# Altium project STB_ValidationBoard.PrjPcb (part 1 of 2)
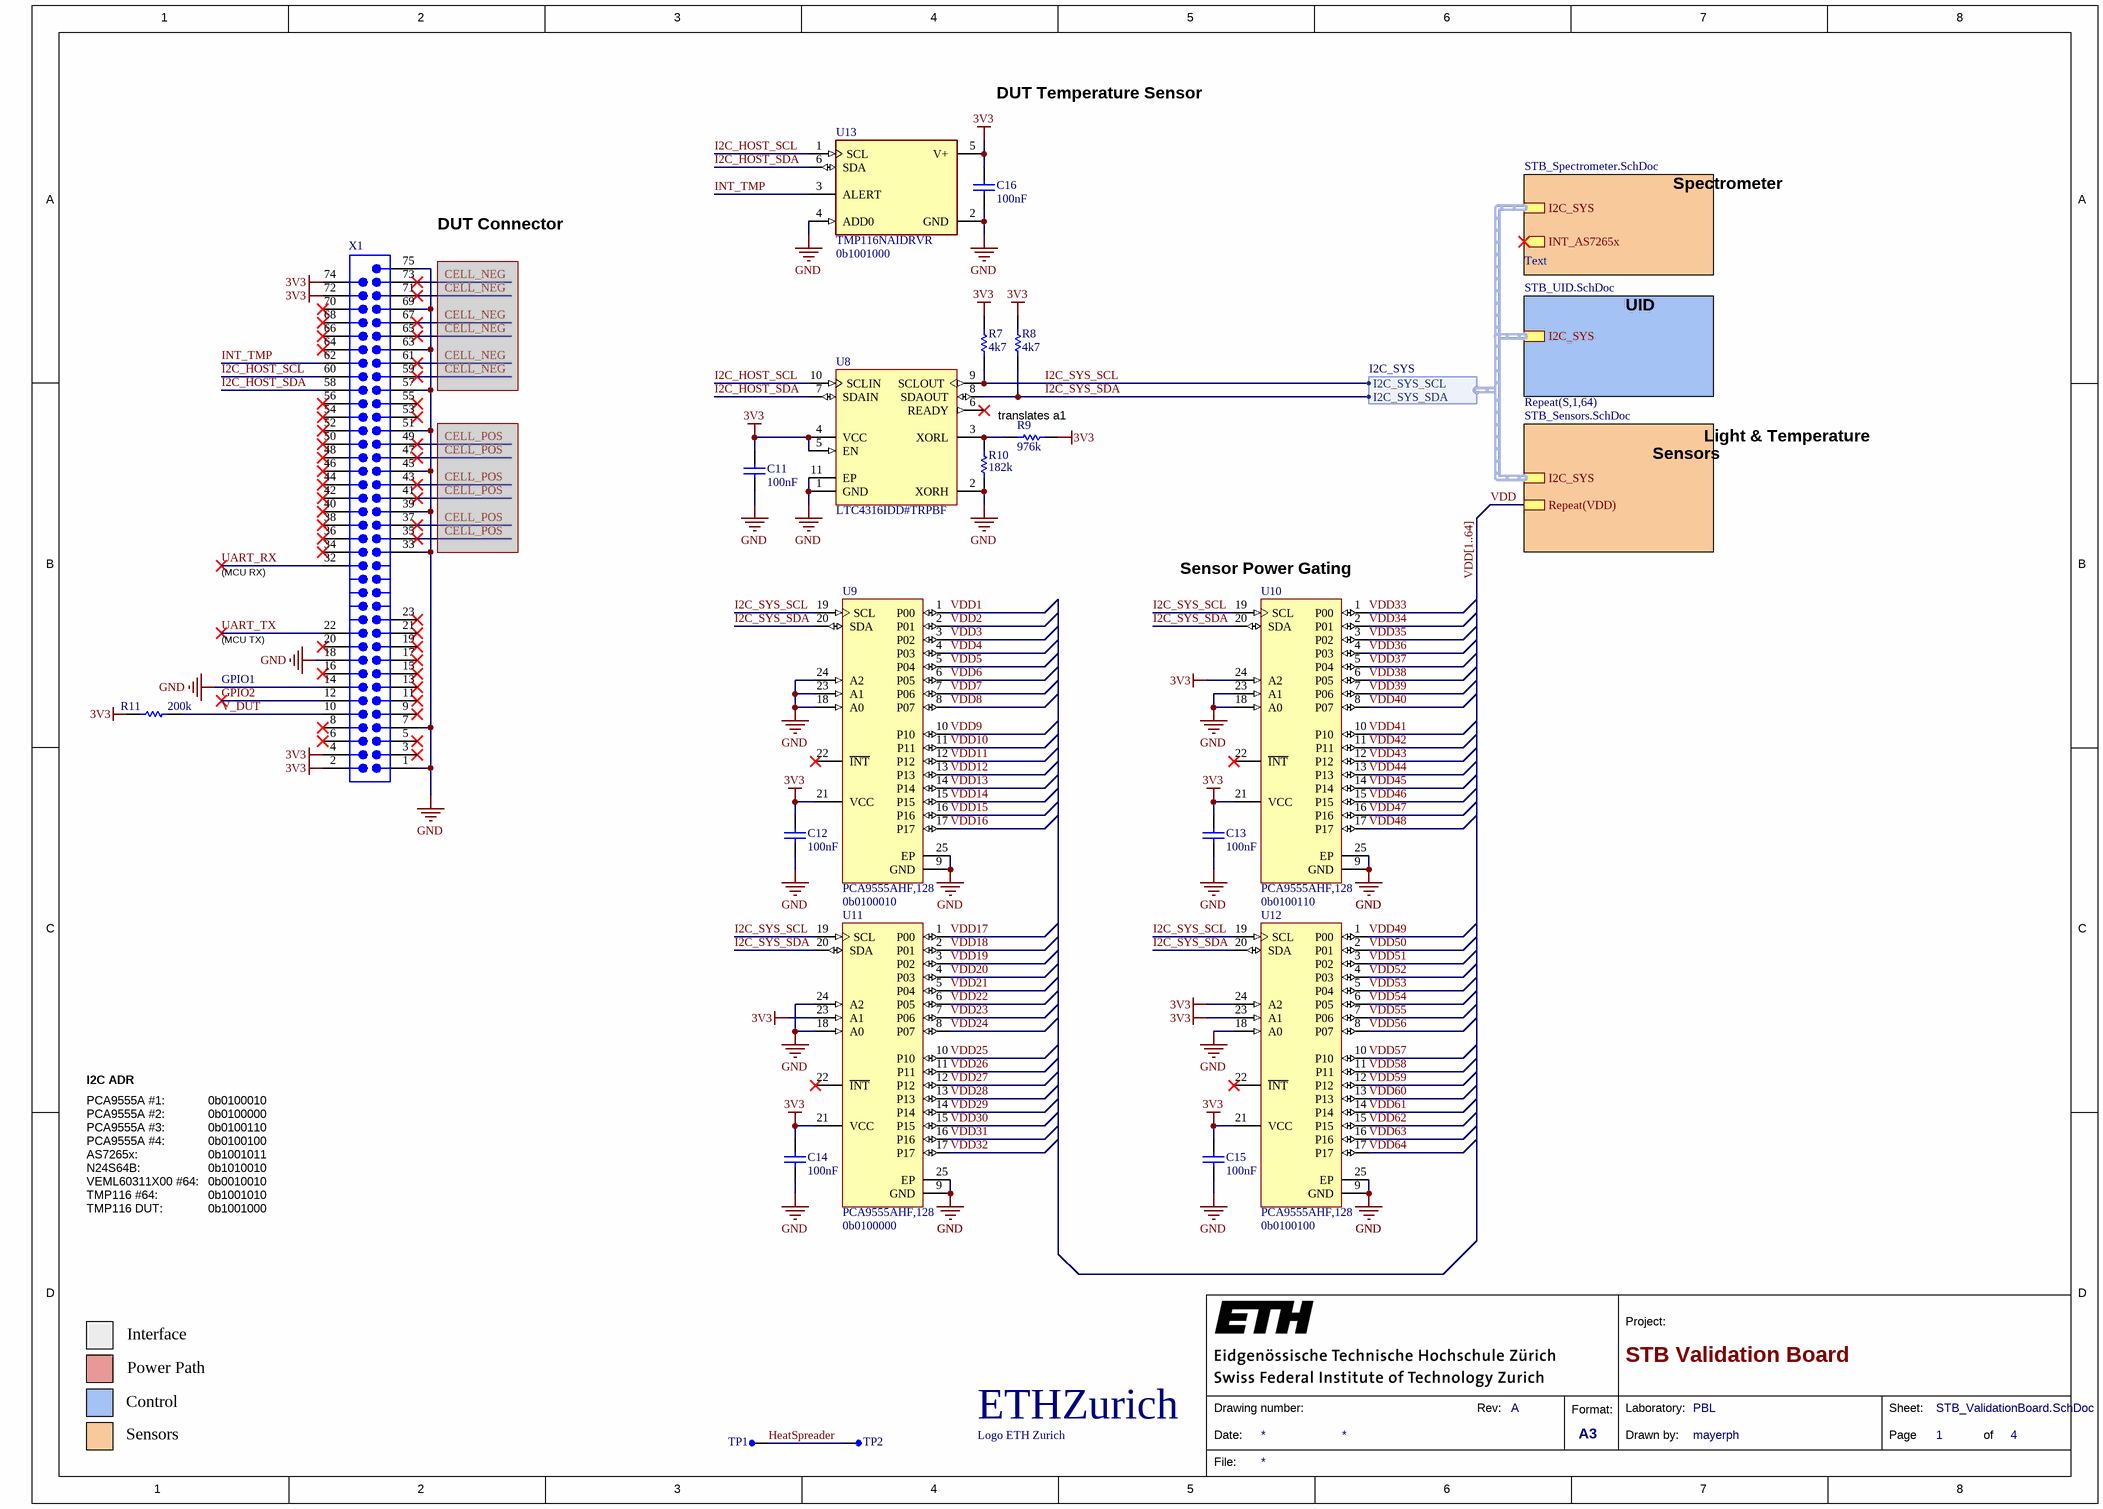
[diagram p0: STB_ValidationBoard.SchDoc]
4 sheets, 235 parts. Net scope: hierarchical (ports join the sheet entries above them; power ports are global).
Board file: STB_ValidationBoard.PcbDoc
Sheets:
  STB_ValidationBoard.SchDoc
    SP = STB_Spectrometer.SchDoc
    TC = STB_UID.SchDoc
    S1 = STB_Sensors.SchDoc
    S2 = STB_Sensors.SchDoc
    S3 = STB_Sensors.SchDoc
    S4 = STB_Sensors.SchDoc
    S5 = STB_Sensors.SchDoc
    S6 = STB_Sensors.SchDoc
    S7 = STB_Sensors.SchDoc
    S8 = STB_Sensors.SchDoc
    S9 = STB_Sensors.SchDoc
    S10 = STB_Sensors.SchDoc
    S11 = STB_Sensors.SchDoc
    S12 = STB_Sensors.SchDoc
    S13 = STB_Sensors.SchDoc
    S14 = STB_Sensors.SchDoc
    S15 = STB_Sensors.SchDoc
    S16 = STB_Sensors.SchDoc
    S17 = STB_Sensors.SchDoc
    S18 = STB_Sensors.SchDoc
    S19 = STB_Sensors.SchDoc
    S20 = STB_Sensors.SchDoc
    S21 = STB_Sensors.SchDoc
    S22 = STB_Sensors.SchDoc
    S23 = STB_Sensors.SchDoc
    S24 = STB_Sensors.SchDoc
    S25 = STB_Sensors.SchDoc
    S26 = STB_Sensors.SchDoc
    S27 = STB_Sensors.SchDoc
    S28 = STB_Sensors.SchDoc
    S29 = STB_Sensors.SchDoc
    S30 = STB_Sensors.SchDoc
    S31 = STB_Sensors.SchDoc
    S32 = STB_Sensors.SchDoc
    S33 = STB_Sensors.SchDoc
    S34 = STB_Sensors.SchDoc
    S35 = STB_Sensors.SchDoc
    S36 = STB_Sensors.SchDoc
    S37 = STB_Sensors.SchDoc
    S38 = STB_Sensors.SchDoc
    S39 = STB_Sensors.SchDoc
    S40 = STB_Sensors.SchDoc
    S41 = STB_Sensors.SchDoc
    S42 = STB_Sensors.SchDoc
    S43 = STB_Sensors.SchDoc
    S44 = STB_Sensors.SchDoc
    S45 = STB_Sensors.SchDoc
    S46 = STB_Sensors.SchDoc
    S47 = STB_Sensors.SchDoc
    S48 = STB_Sensors.SchDoc
    S49 = STB_Sensors.SchDoc
    S50 = STB_Sensors.SchDoc
    S51 = STB_Sensors.SchDoc
    S52 = STB_Sensors.SchDoc
    S53 = STB_Sensors.SchDoc
    S54 = STB_Sensors.SchDoc
    S55 = STB_Sensors.SchDoc
    S56 = STB_Sensors.SchDoc
    S57 = STB_Sensors.SchDoc
    S58 = STB_Sensors.SchDoc
    S59 = STB_Sensors.SchDoc
    S60 = STB_Sensors.SchDoc
    S61 = STB_Sensors.SchDoc
    S62 = STB_Sensors.SchDoc
    S63 = STB_Sensors.SchDoc
    S64 = STB_Sensors.SchDoc

## Sheet STB_ValidationBoard.SchDoc: STB Validation Board
size A3; Author: mayerph; DrawnBy: mayerph; Organization: PBL; Revision: A; SheetNumber: 1; SheetTotal: 4

### Parts
A1  Logo ETH Zurich  [eth-zurich_5mm]  (no BOM)
C11  100nF  [CAPC1050X55X23LL05T13]
C12  100nF  [CAPC1050X55X23LL05T13]
C13  100nF  [CAPC1050X55X23LL05T13]
C14  100nF  [CAPC1050X55X23LL05T13]
C15  100nF  [CAPC1050X55X23LL05T13]
C16  100nF  [CAPC1050X55X23LL05T13]
R7  4k7  [RESC1005X40X25LL05T10]
R8  4k7  [RESC1005X40X25LL05T10]
R9  976k  [RESC1005X40X25LL05T05]
R10  182k  [RESC1005X40X25LL05T05]
R11  200k  [RESC1005X40X25LL05T10]
TP1  testPoint_1mm  [TP-SM-C-100]  (value not drawn)  (no BOM)
TP2  testPoint_1mm  [TP-SM-C-100]  (value not drawn)  (no BOM)
U8  LTC4316IDD#TRPBF  [DFN10(3x3)_N]
U9  PCA9555AHF,128  [RGE0024C]
U10  PCA9555AHF,128  [RGE0024C]
U11  PCA9555AHF,128  [RGE0024C]
U12  PCA9555AHF,128  [RGE0024C]
U13  TMP116NAIDRVR  Address: 0b1001000  [FP-DRV0006B-MFG]
X1  CONN PWR CARD EDGE PCB SLOT MALE  [CON-67_0.5MM_PCB_SLOT]  (value not drawn)  (no BOM)

### Sub-sheets
Repeat(S,1,64) = STB_Sensors.SchDoc: I2C_SYS (harness I2C_SYS), Repeat(VDD)
SP = STB_Spectrometer.SchDoc: I2C_SYS (harness I2C_SYS), INT_AS7265x (out)
TC = STB_UID.SchDoc: I2C_SYS (harness I2C_SYS)

### Harnesses
I2C_SYS: I2C_SYS_SDA, I2C_SYS_SCL

### Nets
3V3: C11.2 C12.2 C13.2 C14.2 C15.2 C16.2 R7.2 R8.2 R9.1 R11.2 U8.4(VCC) U8.5(EN) U9.21(VCC) U10.21(VCC) U10.24(A2) U11.21(VCC) U11.23(A1) U12.21(VCC) U12.23(A1) U12.24(A2) U13.5(V+) X1.2 X1.4 X1.72 X1.74
GND: C11.1 C12.1 C13.1 C14.1 C15.1 C16.1 R10.1 U8.1(GND) U8.2(XORH) U8.11(EP) U9.9(GND) U9.18(A0) U9.23(A1) U9.24(A2) U9.25(EP) U10.9(GND) U10.18(A0) U10.23(A1) U10.25(EP) U11.9(GND) U11.18(A0) U11.24(A2) U11.25(EP) U12.9(GND) U12.18(A0) U12.25(EP) U13.2(GND) U13.4(ADD0) X1.1 X1.7 X1.14 X1.18 X1.33 X1.39 X1.45 X1.51 X1.57 X1.63 X1.69 X1.75
GPIO2: X1.12
HeatSpreader: TP1.1(TP) TP2.1(TP)
I2C_HOST_SCL: U8.10(SCLIN) U13.1(SCL) X1.60
I2C_HOST_SDA: U8.7(SDAIN) U13.6(SDA) X1.58
I2C_SYS_SCL: R7.1 U8.9(SCLOUT) U9.19(SCL) U10.19(SCL) U11.19(SCL) U12.19(SCL) ; sheet SP/I2C_SYS.I2C_SYS_SCL
I2C_SYS_SDA: R8.1 U8.8(SDAOUT) U9.20(SDA) U10.20(SDA) U11.20(SDA) U12.20(SDA) ; sheet SP/I2C_SYS.I2C_SYS_SDA
INT_TMP: U13.3(ALERT) X1.62
UART_RX: X1.32
UART_TX: X1.22
V_DUT: R11.1 X1.10
VDD: sheet Repeat(S,1,64)/Repeat(VDD)
VDD1: U9.1(P00)
VDD2: U9.2(P01)
VDD3: U9.3(P02)
VDD4: U9.4(P03)
VDD5: U9.5(P04)
VDD6: U9.6(P05)
VDD7: U9.7(P06)
VDD8: U9.8(P07)
VDD9: U9.10(P10)
VDD10: U9.11(P11)
VDD11: U9.12(P12)
VDD12: U9.13(P13)
VDD13: U9.14(P14)
VDD14: U9.15(P15)
VDD15: U9.16(P16)
VDD16: U9.17(P17)
VDD17: U11.1(P00)
VDD18: U11.2(P01)
VDD19: U11.3(P02)
VDD20: U11.4(P03)
VDD21: U11.5(P04)
VDD22: U11.6(P05)
VDD23: U11.7(P06)
VDD24: U11.8(P07)
VDD25: U11.10(P10)
VDD26: U11.11(P11)
VDD27: U11.12(P12)
VDD28: U11.13(P13)
VDD29: U11.14(P14)
VDD30: U11.15(P15)
VDD31: U11.16(P16)
VDD32: U11.17(P17)
VDD33: U10.1(P00)
VDD34: U10.2(P01)
VDD35: U10.3(P02)
VDD36: U10.4(P03)
VDD37: U10.5(P04)
VDD38: U10.6(P05)
VDD39: U10.7(P06)
VDD40: U10.8(P07)
VDD41: U10.10(P10)
VDD42: U10.11(P11)
VDD43: U10.12(P12)
VDD44: U10.13(P13)
VDD45: U10.14(P14)
VDD46: U10.15(P15)
VDD47: U10.16(P16)
VDD48: U10.17(P17)
VDD49: U12.1(P00)
VDD50: U12.2(P01)
VDD51: U12.3(P02)
VDD52: U12.4(P03)
VDD53: U12.5(P04)
VDD54: U12.6(P05)
VDD55: U12.7(P06)
VDD56: U12.8(P07)
VDD57: U12.10(P10)
VDD58: U12.11(P11)
VDD59: U12.12(P12)
VDD60: U12.13(P13)
VDD61: U12.14(P14)
VDD62: U12.15(P15)
VDD63: U12.16(P16)
VDD64: U12.17(P17)
NetR9_2: R9.2 R10.2 U8.3(XORL)

Not connected (* = marked no-connect by the designer): U8 6(READY)*; U9 22(~{INT})*; U10 22(~{INT})*; U11 22(~{INT})*; U12 22(~{INT})*; X1 3* 5* 6* 8* 9* 11* 13* 15* 16* 17* 19* 20* 21* 23* 34* 35* 36* 37* 38* 40* 41* 42* 43* 44* 46* 47* 48* 49* 50* 52(51)* 53* 54(52)* 55* 56(53)* 59* 61* 64* 65* 66* 67* 68* 70* 71* 73*

### Buses and harness runs
bus VDD[1..64]
harness sheet Repeat(S,1,64)/I2C_SYS = sheet SP/I2C_SYS = sheet TC/I2C_SYS

### Notes on the sheet
- DUT Temperature Sensor
- (near X1) DUT Connector
- Spectrometer
- Text
- UID
- (near R9) translates a1
- Light & Temperature
- Sensors
- (MCU RX)
- Sensor Power Gating
- (MCU TX)
- GPIO1
- 0b0100010
- 0b0100110
- I2C ADR
- PCA9555A #1:
  PCA9555A #2:
  PCA9555A #3:
  PCA9555A #4:
  AS7265x:
  N24S64B:
  VEML60311X00 #64:
  TMP116 #64:
  TMP116 DUT:
- 0b0100010
  0b0100000
  0b0100110
  0b0100100
  0b1001011
  0b1010010
  0b0010010
  0b1001010
  0b1001000
- (near U11) 0b0100000
- (near U12) 0b0100100
- Interface
- Power Path
- Control
- 1
- 2
- 3
- 4
- 5
- 6
- 7
- 8
- A
- B
- C
- D
- Project:
- Date:
- Drawing number:
- Rev:
- Format:
- A3
- Drawn by:
- Laboratory:
- Page
- Sheet:
- of
- File:
- (in symbol CMP-00038-1) ETHZurich

### Library data of the parts
A1 = CMP-00038-1
C11-C16 = CMP-2000-05439-1: Chip Capacitor, 100 nF, +/- 10%, 16 V, -55 to 125 degC, 0402 (1005 Metric), RoHS, Tape and Reel; Manufacturer: Samsung Electro-Mechanics; Manufacturer Part Number: CL05B104KO5NNNC; Dielectric: X7R; Rated Voltage: 16V; Dielectric Material: Ceramic; Multilayer: Yes; Case Size/Dimension: 0402; Tolerance (%): ±10%; Value: 100nF; Manufacturer URL: http://www.samsungsem.com/global/index.jsp; Datasheet URL: https://datasheet.ciiva.com/29198/458718-da-01-en-vs-kondensator-0402-29198423.pdf; Datasheet Version: Nov-10; Supplier 1: Digi-Key; Supplier Part Number 1: 1276-1001-6-ND; RoHS: Yes; Category: Ceramic Capacitors; Stock 1: 24854634; Pricing 1: 1=0.10000, 10=0.02400, 50=0.01300, 100=0.01050, 500=0.00752, 1000=0.00592, 2500=0.00538, 5000=0.00495 (USD); Mount: Surface Mount; Number of Pins: 2; Package Shape: Rectangular; Size Code: 0402; Terminal Finish: Nickel; Min Operating Temperature: -55°C; Max Operating Temperature: 125°C; JESD-609 Code: e3; Capacitor Type: Ceramic; Negative Tolerance: 10%; Packaging: Tape and Reel; Positive Tolerance: 10%; Rated DC Voltage (URdc): 16V; Temperature Characteristics Code: X7R; Termination: Wraparound; Package Style: SMTMeter; Length: 1mm; Width: 0.5mm; Height: 0.55mm; REACH SVHC: Yes; RoHS Compliant: Yes; ComponentLink1URL: https://datasheet.ciiva.com:443/pdfs/VipMasterIC/IC/SEMS/SEMS-S-A0008384515/SEMS-S-A0008872921-1.pdf?src-supplier=IHS+Markit; ComponentLink1Description: https://datasheet.ciiva.com:443/pdfs/VipMasterIC/IC/SEMS/SEMS-S-A0008384515/SEMS-S-A0008872921-1.pdf?src-supplier=IHS+Markit; ComponentLink2URL: https://datasheet.ciiva.com/26920/getdatasheetpartid-359683-26920169.pdf?src-supplier=Verical; ComponentLink2Description: https://datasheet.ciiva.com/26920/getdatasheetpartid-359683-26920169.pdf?src-supplier=Verical; ComponentLink3URL: https://datasheet.ciiva.com/29198/458718-da-01-en-vs-kondensator-0402-29198423.pdf?src-supplier=Conrad; ComponentLink3Description: https://datasheet.ciiva.com/29198/458718-da-01-en-vs-kondensator-0402-29198423.pdf?src-supplier=Conrad; ComponentLink4URL: https://datasheet.ciiva.com/26309/mlcc-catalogdownload2013-eng-26309003.pdf?src-supplier=Distrelec; ComponentLink4Description: https://datasheet.ciiva.com/26309/mlcc-catalogdownload2013-eng-26309003.pdf?src-supplier=Distrelec; ComponentLink5URL: https://datasheet.ciiva.com/16208/cl05b104kq5nnnc-16208343.pdf?src-supplier=Future+Electronics; ComponentLink5Description: https://datasheet.ciiva.com/16208/cl05b104kq5nnnc-16208343.pdf?src-supplier=Future+Electronics
R7 R8 = CMP-1011-00586-2: Manufacturer: Yageo / Phycomp; Part Number: RC0402FR-074K7L; Tolerance: 1%; Rated Power Dissipation (P): 62.5mW; Rated Temperature: 70°C; Value: 4.7 kOhm; Temperature Coefficient: 100ppm/°C; Working Voltage: 50V; Additional Feature: LASER TRIMMABLE; Package Height: 0.35mm; Package Length: 1mm; Package Width: 0.5mm; Supplier 1: Digi-Key; Supplier Part Number 1: 311-4.7KLRDKR-ND; Manufacturer Part Number: RC0402FR-074K7L; RoHS: Yes; Category: Chip SMD Resistors; Stock 1: 23638739; Pricing 1: 1=0.10000, 10=0.01500, 100=0.00600, 1000=0.00267, 2500=0.00232, 5000=0.00192 (USD); Mount: Surface Mount; Number of Pins: 2; Package Shape: Rectangular; Size Code: 0402; Terminal Finish: Nickel; Min Operating Temperature: -55°C; Max Operating Temperature: 155°C; Resistor Type: FIXED RESISTOR; Packaging: Tape and Reel; Technology: METAL GLAZE/THICK FILM; Termination: Wraparound; JESD-609 Code: e3; Construction: Chip; Package Style: SMTMeter; REACH SVHC: Yes; RoHS Compliant: Yes; ComponentLink1URL: https://datasheet.ciiva.com:443/pdfs/VipMasterIC/IC/YAGO/YAGO-S-A0008145938/YAGO-S-A0008145938-1.pdf?src-supplier=IHS+Markit; ComponentLink1Description: https://datasheet.ciiva.com:443/pdfs/VipMasterIC/IC/YAGO/YAGO-S-A0008145938/YAGO-S-A0008145938-1.pdf?src-supplier=IHS+Markit; ComponentLink2URL: https://datasheet.ciiva.com/22661/1686128-22661342.pdf?src-supplier=Element14; ComponentLink2Description: https://datasheet.ciiva.com/22661/1686128-22661342.pdf?src-supplier=Element14; ComponentLink3URL: https://datasheet.ciiva.com/7850/1018594-7850022.pdf?src-supplier=Element14; ComponentLink3Description: https://datasheet.ciiva.com/7850/1018594-7850022.pdf?src-supplier=Element14; ComponentLink4URL: https://datasheet.ciiva.com/7850/1018594-7850023.pdf?src-supplier=Element14; ComponentLink4Description: https://datasheet.ciiva.com/7850/1018594-7850023.pdf?src-supplier=Element14; ComponentLink5URL: https://datasheet.ciiva.com/15215/getdatasheetpartid-328119-15215035.pdf?src-supplier=Verical; ComponentLink5Description: https://datasheet.ciiva.com/15215/getdatasheetpartid-328119-15215035.pdf?src-supplier=Verical
R9 = CMP-2002-01120-1: Manufacturer: Panasonic; Part Number: ERJ-2RKF9763X; Tolerance: 1%; Rated Power Dissipation (P): 100mW; Rated Temperature: 70°C; Value: 976 kOhm; Temperature Coefficient: 100ppm/°C; Working Voltage: 50V; Package Height: 0.35mm; Package Length: 1mm; Package Width: 0.5mm; Reference Standard: AEC-Q200; Supplier 1: Digi-Key; Supplier Part Number 1: P976KLDKR-ND; Manufacturer Part Number: ERJ-2RKF9763X; RoHS: Yes; Category: Chip SMD Resistors; Stock 1: 136638; Pricing 1: 1=0.10000, 10=0.03300, 100=0.01330, 1000=0.00599, 2500=0.00520, 5000=0.00429 (USD); Mount: Surface Mount; Number of Pins: 2; Size Code: 0402; Terminal Finish: Nickel; Package Shape: Rectangular; Min Operating Temperature: -55°C; Max Operating Temperature: 155°C; Resistor Type: FIXED RESISTOR; Construction: Rectangular; Package Style: SMTMeter; Packaging: Tape and Reel; Termination: Wraparound; JESD-609 Code: e3; Technology: METAL GLAZE/THICK FILM; REACH SVHC: Yes; RoHS Compliant: Yes; ComponentLink1URL: https://datasheet.ciiva.com:443/pdfs/VipMasterIC/IC/PANA/PANA-S-A0009889626/PANA-S-A0009889626-1.pdf?src-supplier=IHS+Markit; ComponentLink1Description: https://datasheet.ciiva.com:443/pdfs/VipMasterIC/IC/PANA/PANA-S-A0009889626/PANA-S-A0009889626-1.pdf?src-supplier=IHS+Markit; ComponentLink2URL: https://datasheet.ciiva.com/43467/1678782-43467581.pdf?src-supplier=Farnell; ComponentLink2Description: https://datasheet.ciiva.com/43467/1678782-43467581.pdf?src-supplier=Farnell; ComponentLink3URL: https://datasheet.ciiva.com/46372/1678782-46372911.pdf?src-supplier=Element14; ComponentLink3Description: https://datasheet.ciiva.com/46372/1678782-46372911.pdf?src-supplier=Element14; ComponentLink4URL: https://datasheet.ciiva.com/22668/1678782-22668415.pdf?src-supplier=Element14; ComponentLink4Description: https://datasheet.ciiva.com/22668/1678782-22668415.pdf?src-supplier=Element14; ComponentLink5URL: https://datasheet.ciiva.com/16758/70260748-16758903.pdf?src-supplier=Allied+Electronics; ComponentLink5Description: https://datasheet.ciiva.com/16758/70260748-16758903.pdf?src-supplier=Allied+Electronics; ComponentLink6URL: https://datasheet.ciiva.com/9179/aoa0000ce2-9179357.pdf?src-supplier=Avnet; ComponentLink6Description: https://datasheet.ciiva.com/9179/aoa0000ce2-9179357.pdf?src-supplier=Avnet; ComponentLink7URL: https://datasheet.ciiva.com/30176/aoa0000ce2-30176831.pdf?src-supplier=Onlinecomponents.com; ComponentLink7Description: https://datasheet.ciiva.com/30176/aoa0000ce2-30176831.pdf?src-supplier=Onlinecomponents.com
R10 = CMP-2002-08256-1: Manufacturer: Vishay Dale; Part Number: CRCW0402182KFKED; Value: 182 kOhm; Tolerance: 1%; Rated Power Dissipation (P): 63mW; Resistance: 182kR; Temperature Coefficient: 100ppm/°C; Working Voltage: 50V; Rated Temperature: 70°C; Package Height: 0.35mm; Package Length: 1mm; Package Width: 0.5mm; Reference Standard: AEC-Q200; Supplier 1: Digi-Key; Supplier Part Number 1: 541-182KLDKR-ND; Manufacturer Part Number: CRCW0402182KFKED; RoHS: Yes; Category: Chip SMD Resistors; Stock 1: 76709; Pricing 1: 1=0.10000, 10=0.03600, 100=0.01460, 1000=0.00656, 2500=0.00569, 5000=0.00470 (USD); Mount: Surface Mount; Number of Pins: 2; Size Code: 0402; Terminal Finish: Nickel; Package Shape: Rectangular; Min Operating Temperature: -55°C; Max Operating Temperature: 155°C; JESD-609 Code: e3; Resistor Type: FIXED RESISTOR; Construction: Chip; Package Style: SMTMeter; Packaging: Tape and Reel; Technology: METAL GLAZE/THICK FILM; Termination: Wraparound; Reach SVHC Compliant: Yes; RoHS Compliant: Yes; ComponentLink1URL: https://datasheet.ciiva.com:443/pdfs/VipMasterIC/IC/VISH/VISH-S-A0007266705/VISH-S-A0007266705-1.pdf?src-supplier=IHS+Markit; ComponentLink1Description: https://datasheet.ciiva.com:443/pdfs/VipMasterIC/IC/VISH/VISH-S-A0007266705/VISH-S-A0007266705-1.pdf?src-supplier=IHS+Markit; ComponentLink2URL: https://datasheet.ciiva.com/3256/dcrcwe3-3256117.pdf?src-supplier=Avnet; ComponentLink2Description: https://datasheet.ciiva.com/3256/dcrcwe3-3256117.pdf?src-supplier=Avnet; ComponentLink3URL: https://datasheet.ciiva.com/2463/dcrcwe3-2463286.pdf?src-supplier=Digi-Key; ComponentLink3Description: https://datasheet.ciiva.com/2463/dcrcwe3-2463286.pdf?src-supplier=Digi-Key; ComponentLink4URL: https://datasheet.ciiva.com/5545/dcrcwe3-109170-5545910.pdf?src-supplier=Mouser; ComponentLink4Description: https://datasheet.ciiva.com/5545/dcrcwe3-109170-5545910.pdf?src-supplier=Mouser; ComponentLink5URL: https://datasheet.ciiva.com/2463/dcrcwe3-2463287.pdf?src-supplier=Digi-Key; ComponentLink5Description: https://datasheet.ciiva.com/2463/dcrcwe3-2463287.pdf?src-supplier=Digi-Key; ComponentLink6URL: https://datasheet.ciiva.com/7714/1697337-7714183.pdf?src-supplier=Element14; ComponentLink6Description: https://datasheet.ciiva.com/7714/1697337-7714183.pdf?src-supplier=Element14; ComponentLink7URL: https://datasheet.ciiva.com/2463/dcrcwe3-2463288.pdf?src-supplier=Digi-Key; ComponentLink7Description: https://datasheet.ciiva.com/2463/dcrcwe3-2463288.pdf?src-supplier=Digi-Key; ComponentLink8URL: https://datasheet.ciiva.com/16785/70201119-16785993.pdf?src-supplier=Allied+Electronics; ComponentLink8Description: https://datasheet.ciiva.com/16785/70201119-16785993.pdf?src-supplier=Allied+Electronics; ComponentLink9URL: https://datasheet.ciiva.com/7714/1697337-7714365.pdf?src-supplier=Element14; ComponentLink9Description: https://datasheet.ciiva.com/7714/1697337-7714365.pdf?src-supplier=Element14
R11 = CMP-2002-07497-1: Part Number: RC0402FR-07200KL; Manufacturer: Yageo / Phycomp; Tolerance: 1%; Rated Power Dissipation (P): 62.5mW; Rated Temperature: 70°C; Value: 200 kOhm; Temperature Coefficient: 100ppm/°C; Working Voltage: 50V; Additional Feature: LASER TRIMMABLE; Package Height: 0.35mm; Package Length: 1mm; Package Width: 0.5mm; Supplier 1: Digi-Key; Supplier Part Number 1: 311-200KLRDKR-ND; Manufacturer Part Number: RC0402FR-07200KL; RoHS: Yes; Category: Chip SMD Resistors; Stock 1: 2033311; Pricing 1: 1=0.10000, 10=0.01500, 100=0.00600, 1000=0.00267, 2500=0.00232, 5000=0.00192 (USD); Mount: Surface Mount; Number of Pins: 2; Size Code: 0402; Package Shape: Rectangular; Terminal Finish: Nickel; Min Operating Temperature: -55°C; Max Operating Temperature: 155°C; Resistor Type: FIXED RESISTOR; Construction: Chip; Package Style: SMTMeter; Technology: METAL GLAZE/THICK FILM; Termination: Wraparound; Packaging: Tape and Reel; JESD-609 Code: e3; REACH SVHC: Yes; RoHS Compliant: Yes; ComponentLink1URL: https://datasheet.ciiva.com:443/pdfs/VipMasterIC/IC/YAGO/YAGO-S-A0008145938/YAGO-S-A0008145938-1.pdf?src-supplier=IHS+Markit; ComponentLink1Description: https://datasheet.ciiva.com:443/pdfs/VipMasterIC/IC/YAGO/YAGO-S-A0008145938/YAGO-S-A0008145938-1.pdf?src-supplier=IHS+Markit; ComponentLink2URL: https://datasheet.ciiva.com/7849/1018594-7849897.pdf?src-supplier=Element14; ComponentLink2Description: https://datasheet.ciiva.com/7849/1018594-7849897.pdf?src-supplier=Element14; ComponentLink3URL: https://datasheet.ciiva.com/7849/1018594-7849896.pdf?src-supplier=Element14; ComponentLink3Description: https://datasheet.ciiva.com/7849/1018594-7849896.pdf?src-supplier=Element14; ComponentLink4URL: https://datasheet.ciiva.com/46394/1018594-46394953.pdf?src-supplier=Element14; ComponentLink4Description: https://datasheet.ciiva.com/46394/1018594-46394953.pdf?src-supplier=Element14; ComponentLink5URL: https://datasheet.ciiva.com/2453/pyu-r-int-thick-7-2453557.pdf?src-supplier=Digi-Key; ComponentLink5Description: https://datasheet.ciiva.com/2453/pyu-r-int-thick-7-2453557.pdf?src-supplier=Digi-Key; ComponentLink6URL: https://datasheet.ciiva.com/2453/pyu-r-int-thick-7-2453558.pdf?src-supplier=Digi-Key; ComponentLink6Description: https://datasheet.ciiva.com/2453/pyu-r-int-thick-7-2453558.pdf?src-supplier=Digi-Key; ComponentLink7URL: https://datasheet.ciiva.com/2453/pyu-r-int-thick-7-2453556.pdf?src-supplier=Digi-Key; ComponentLink7Description: https://datasheet.ciiva.com/2453/pyu-r-int-thick-7-2453556.pdf?src-supplier=Digi-Key; ComponentLink8URL: https://datasheet.ciiva.com/12667/pyu-rc0402-51-rohs-l-6-r-12667911.pdf?src-supplier=Mouser; ComponentLink8Description: https://datasheet.ciiva.com/12667/pyu-rc0402-51-rohs-l-6-r-12667911.pdf?src-supplier=Mouser; ComponentLink9URL: https://datasheet.ciiva.com/15189/getdatasheetpartid-323720-15189381.pdf?src-supplier=Verical; ComponentLink9Description: https://datasheet.ciiva.com/15189/getdatasheetpartid-323720-15189381.pdf?src-supplier=Verical; ComponentLink10URL: https://datasheet.ciiva.com/16740/pyu-rc0402-51-rohs-l-6-r-16740636.pdf?src-supplier=Future+Electronics; ComponentLink10Description: https://datasheet.ciiva.com/16740/pyu-rc0402-51-rohs-l-6-r-16740636.pdf?src-supplier=Future+Electronics
TP1 TP2 = testPoint_1mm: testPoint 1mm
U8 = CMP-02068-1: Single I2C/SMBus Address Translator; Manufacturer: Analog Devices / Linear Technology; Interface IC Type: INTERFACE CIRCUIT; Max Supply Voltage: 5.5V; Min Supply Voltage: 2.25V; Number of Functions: 1; Package Body Material: Plastic; Supply Voltage-Nom: 3.3V; Height - Seated (Max): 0.8mm; JESD-30 Code: S-PDSO-N10; Length: 3mm; Max Operating Temperature: 85°C; Min Operating Temperature: -40°C; Number of Pins: 10; Package Code: VSON; Package Shape: Square; Package Style: SMALL OUTLINE, VERY THIN PROFILEMeter; REACH SVHC: Yes; RoHS Compliant: Yes; Surface Mount: Yes; Technology: CMOS; Temperature Grade: INDUSTRIAL; Terminal Form: No Lead; Terminal Pitch: 0.5mm; Terminal Position: DUAL; Width: 3mm; Supplier 1: Digi-Key; Supplier Part Number 1: 505-LTC4316IDD#TRPBFDKR-ND; Manufacturer Part Number: LTC4316IDD#TRPBF; RoHS: Yes; Category: Interface ICs; Stock 1: 531; Pricing 1: 1=5.70000, 10=5.12100, 25=4.84160, 100=4.19600, 250=3.98084, 500=3.57198, 1000=3.04500 (USD); ComponentLink1URL: https://datasheet.ciiva.com:443/pdfs/VipMasterIC/IC/LITC/LITC-S-A0001226702/LITC-S-A0001226702-1.pdf?src-supplier=IHS+Markit; ComponentLink1Description: https://datasheet.ciiva.com:443/pdfs/VipMasterIC/IC/LITC/LITC-S-A0001226702/LITC-S-A0001226702-1.pdf?src-supplier=IHS+Markit; ComponentLink2URL: http://www.linear.com/docs/46527?src-supplier=Digi-Key; ComponentLink2Description: http://www.linear.com/docs/46527?src-supplier=Digi-Key
U9-U12 = CMP-0314-00043-2: Manufacturer: NXP Semiconductors; Package Body Material: Plastic; Number of Bits: 16; Number of Ports: 2; Package Equivalence Code: LCC24,.16SQ,20; Power Supplies: 1.8/5V; Max Supply Voltage: 5.5V; Min Supply Voltage: 1.65V; Supply Voltage-Nom: 1.8V; Qualification Status: Not Qualified; Supplier 1: Digi-Key; Supplier Part Number 1: 568-9942-1-ND; Manufacturer Part Number: PCA9555AHF,128; RoHS: Yes; Category: Interface ICs; Stock 1: 565; Pricing 1: 1=2.47000, 10=2.22300, 25=2.09680, 100=1.78650, 250=1.67748, 500=1.46780, 1000=1.32601 (USD); Package Code: VQCCN; Number of Pins: 24; Package Shape: Square; Min Operating Temperature: -40°C; Max Operating Temperature: 85°C; Moisture Sensitivity Level: 1; Number of I/O Lines: 16; Package Style: CHIP CARRIER, VERY THIN PROFILEMeter; Surface Mount: Yes; Technology: CMOS; Terminal Form: No Lead; Terminal Position: QUAD; Length: 4mm; Width: 4mm; Height - Seated (Max): 0.8mm; Terminal Pitch: 0.5mm; Temperature Grade: INDUSTRIAL; REACH SVHC: Yes; RoHS Compliant: Yes; ComponentLink1URL: https://datasheet.ciiva.com:443/pdfs/VipMasterIC/IC/PHGL/PHGL-S-A0001284358/PHGL-S-A0001284358-1.pdf?src-supplier=IHS+Markit; ComponentLink1Description: https://datasheet.ciiva.com:443/pdfs/VipMasterIC/IC/PHGL/PHGL-S-A0001284358/PHGL-S-A0001284358-1.pdf?src-supplier=IHS+Markit; ComponentLink2URL: https://datasheet.ciiva.com/12072/pca9555a-211666-12072629.pdf?src-supplier=Mouser; ComponentLink2Description: https://datasheet.ciiva.com/12072/pca9555a-211666-12072629.pdf?src-supplier=Mouser; ComponentLink3URL: https://datasheet.ciiva.com/6633/pca9555a-6633081.pdf?src-supplier=Digi-Key; ComponentLink3Description: https://datasheet.ciiva.com/6633/pca9555a-6633081.pdf?src-supplier=Digi-Key; ComponentLink4URL: https://datasheet.ciiva.com/6633/design-con-2003-tecforum-i2c-bus-overview-6633083.pdf?src-supplier=Digi-Key; ComponentLink4Description: https://datasheet.ciiva.com/6633/design-con-2003-tecforum-i2c-bus-overview-6633083.pdf?src-supplier=Digi-Key; ComponentLink5URL: https://datasheet.ciiva.com/6633/design-con-2003-tecforum-i2c-bus-overview-6633082.pdf?src-supplier=Digi-Key; ComponentLink5Description: https://datasheet.ciiva.com/6633/design-con-2003-tecforum-i2c-bus-overview-6633082.pdf?src-supplier=Digi-Key; ComponentLink6URL: https://datasheet.ciiva.com/46433/1845292-46433837.pdf?src-supplier=Element14; ComponentLink6Description: https://datasheet.ciiva.com/46433/1845292-46433837.pdf?src-supplier=Element14
U13 = CMP-04948-000013-1: SENSOR DIGITAL -55C-125C 6WSON; Manufacturer: Texas Instruments; Sensor Output: I2C,SMBus; Max Junction Temp: +150°C; Standoff Height: 0mm; Min Supply Voltage: 1.9V; Max Supply Voltage: 5.5V; Resolution: 16bits; Operating Supply Current: 3.5-135uA; Package Shape/Style: Square; Accuracy-Max (Cel): 0.5°C; Number of Bits: 16; Output Interface Type: 2-Wire; Sensors/Transducers Type: TEMPERATURE SENSOR,SWITCH/DIGITAL OUTPUT,SERIAL; Body Breadth: 2inch; Body Height: 0.8mm; Body Length or Diameter: 2mm; Manufacturer Part Number: TMP116NAIDRVR; Temperature Range Low: -55°C; Temperature: -55°C to +125°C; Ipc Land Pattern Name: DFN200X200X80-6; Device Class L1: Sensors; Package: DRV0006B; Interface: I2C,SMBus; Device Class L3: unset; Ambient Temperature Range Low: -55°C; Lead Free: Yes; Height: 0.8mm; Temperature Range High: +125°C; Digikey Description: SENSOR DIGITAL -55C-125C 6WSON; RoHS: TRUE; Mouser Description: ±0.2°C Accurate Digital Temperature Sensor With NV Memory 6-WSON -55 to 125; Ambient Temperature Range High: +150°C; ComponentLink2Description: Datasheet; Category: IC; Device Class L2: Temperature and Humidity Sensors; ComponentLink2URL: https://www.ti.com/lit/ds/symlink/tmp116.pdf; Octopart: https://octopart.com/tmp116naidrvr-texas+instruments-82367758; Automotive: No; Supplier 1: Digi-Key; Supplier Part Number 1: 296-48306-6-ND; Stock 1: 6627; Pricing 1: 1=2.48000, 10=2.22500, 25=2.09880, 100=1.78820, 250=1.67904, 500=1.46916, 1000=1.26720 (USD); Mount: Surface Mount; Housing Material: Plastic; Terminal Finish: Nickel; Min Operating Temperature: -55°C; Max Operating Temperature: 150°C; JESD-609 Code: e4; Termination: Solder; REACH SVHC: Yes; RoHS Compliant: Yes; ComponentLink1URL: https://www.ti.com:443/lit/ds/symlink/tmp116.pdf?src-supplier=IHS+Markit; ComponentLink1Description: https://www.ti.com:443/lit/ds/symlink/tmp116.pdf?src-supplier=IHS+Markit; ComponentLink3URL: http://www.ti.com/lit/ds/symlink/tmp116.pdf?src-supplier=Digi-Key; ComponentLink3Description: http://www.ti.com/lit/ds/symlink/tmp116.pdf?src-supplier=Digi-Key
X1 = CMP-01224-1: Mates with 2199119-4 - No BOM; Number of Positions: 67; Pitch: 0.5mm; Card Thickness: 0.8mm; Card Type: Non Specified - Dual Edge; Gender: Male; Mates with: 2199119-4

## Sheet STB_Spectrometer.SchDoc: STB Validation Board - Spectrometer
size A4; Author: mayerph; DrawnBy: mayerph; Organization: PBL; Revision: A; SheetNumber: 3; SheetTotal: 4
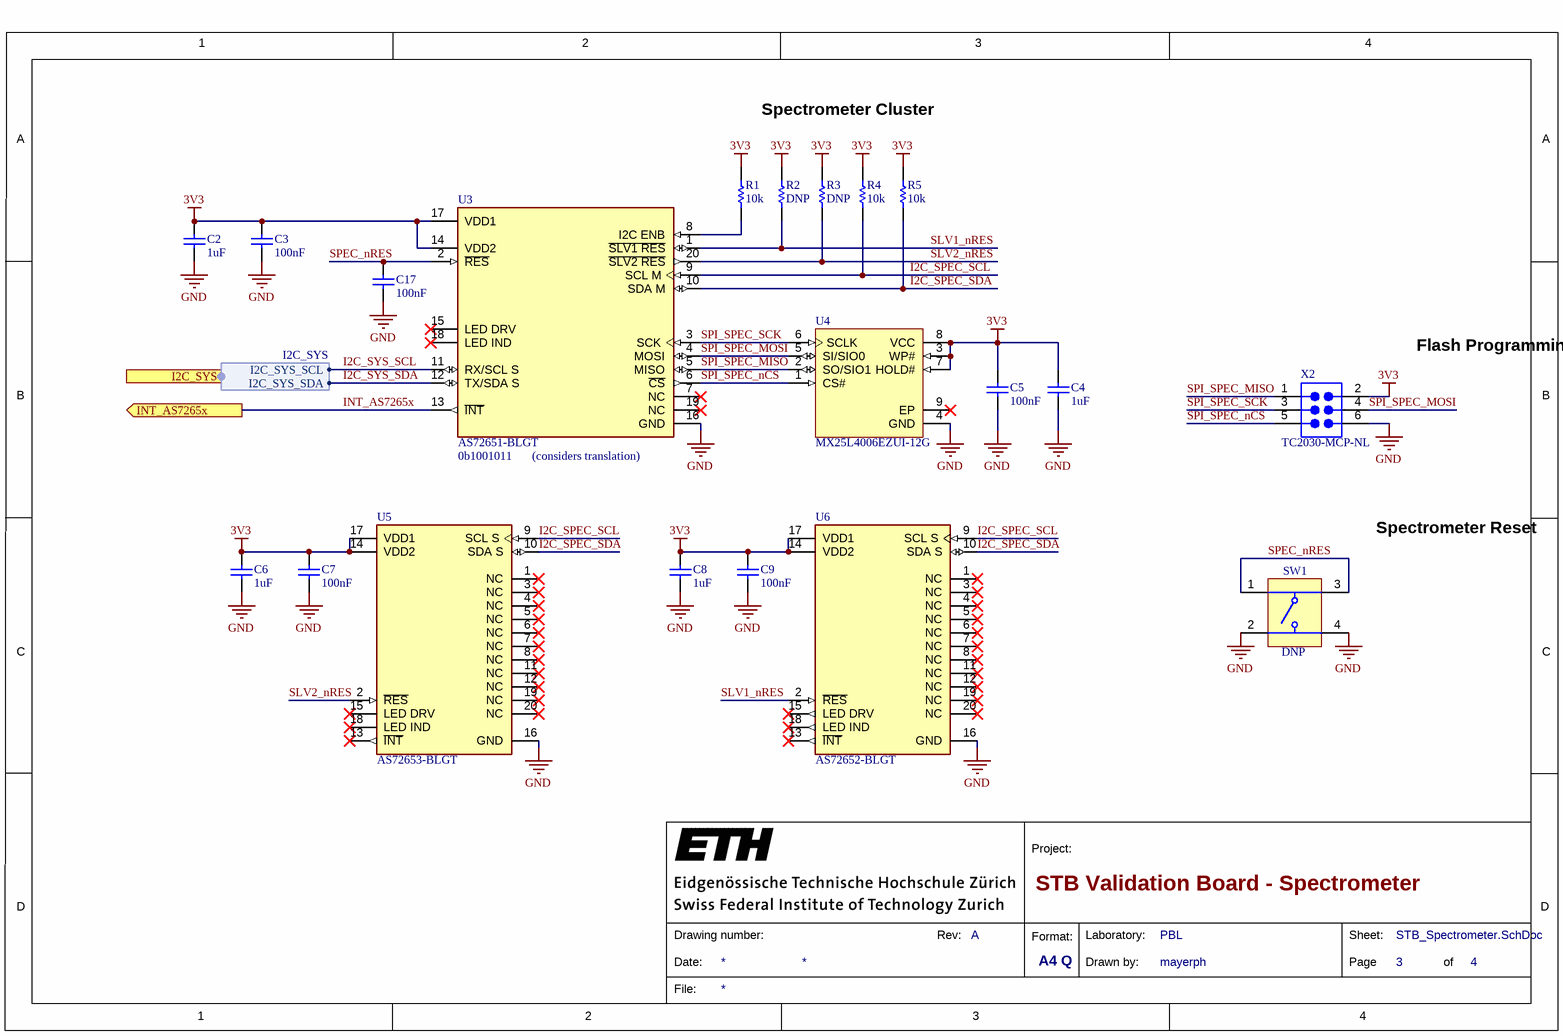
[diagram p1: STB_Spectrometer.SchDoc]

### Parts
C2  1uF  [CAPC1608X90X35LL15T15]
C3  100nF  [CAPC1050X55X23LL05T13]
C4  1uF  [CAPC1608X90X35LL15T15]
C5  100nF  [CAPC1050X55X23LL05T13]
C6  1uF  [CAPC1608X90X35LL15T15]
C7  100nF  [CAPC1050X55X23LL05T13]
C8  1uF  [CAPC1608X90X35LL15T15]
C9  100nF  [CAPC1050X55X23LL05T13]
C17  100nF  [CAPC1050X55X23LL05T13]
R1  10k  [RESC1005X40X25LL05T05]
R2  DNP  [RESC1005X40X25LL05T05]
R3  DNP  [RESC1005X40X25LL05T05]
R4  10k  [RESC1005X40X25LL05T05]
R5  10k  [RESC1005X40X25LL05T05]
SW1  DNP  [PNSC-EVPAA_V]
U3  AS72651-BLGT  Address: 0b1001011  [FP-AS72651-BLGT-MFG]
U4  MX25L4006EZUI-12G  [MXIC-USON-8_V]
U5  AS72653-BLGT  [FP-AS72653-BLGT-MFG]
U6  AS72652-BLGT  [FP-AS72652-BLGT-MFG]
X2  TC2030-MCP-NL  [TC2030-MCP-NL]  (no BOM)

### Ports
I2C_SYS (harness I2C_SYS, see STB_ValidationBoard[6A], STB_Sensors[1A], STB_UID[1A]), INT_AS7265x (out, see STB_ValidationBoard[6A])

### Harnesses
I2C_SYS: I2C_SYS_SDA, I2C_SYS_SCL

### Nets
3V3: C2.2 C3.2 C4.2 C5.2 C6.2 C7.2 C8.2 C9.2 R1.2 R2.2 R3.2 R4.2 R5.2 U3.14(VDD2) U3.17(VDD1) U4.3(WP#) U4.7(HOLD#) U4.8(VCC) U5.14(VDD2) U5.17(VDD1) U6.14(VDD2) U6.17(VDD1) X2.2
GND: C2.1 C3.1 C4.1 C5.1 C6.1 C7.1 C8.1 C9.1 C17.1 SW1.2(B) SW1.4(B') U3.16(GND) U4.4(GND) U5.16(GND) U6.16(GND) X2.6
I2C_SPEC_SCL: R4.1 U3.9(SCL_M) U5.9(SCL_S) U6.9(SCL_S)
I2C_SPEC_SDA: R5.1 U3.10(SDA_M) U5.10(SDA_S) U6.10(SDA_S)
I2C_SYS_SCL: U3.11(RX/SCL_S) ; port I2C_SYS.I2C_SYS_SCL
I2C_SYS_SDA: U3.12(TX/SDA_S) ; port I2C_SYS.I2C_SYS_SDA
INT_AS7265x: U3.13(~{INT}) ; port INT_AS7265x
SLV1_nRES: R2.1 U3.1(~{SLV1_RES}) U6.2(~{RES})
SLV2_nRES: R3.1 U3.20(~{SLV2_RES}) U5.2(~{RES})
SPEC_nRES: C17.2 SW1.1(A) SW1.3(A') U3.2(~{RES})
SPI_SPEC_MISO: U3.5(MISO) U4.2(SO/SIO1) X2.1
SPI_SPEC_MOSI: U3.4(MOSI) U4.5(SI/SIO0) X2.4
SPI_SPEC_nCS: U3.6(~{CS}) U4.1(CS#) X2.5
SPI_SPEC_SCK: U3.3(SCK) U4.6(SCLK) X2.3
NetR1_1: R1.1 U3.8(I2C_ENB)

Not connected (* = marked no-connect by the designer): U3 7(NC)* 15(LED_DRV)* 18(LED_IND)* 19(NC)*; U4 9(EP)*; U5 1(NC)* 3(NC)* 4(NC)* 5(NC)* 6(NC)* 7(NC)* 8(NC)* 11(NC)* 12(NC)* 13(~{INT})* 15(LED_DRV)* 18(LED_IND)* 19(NC)* 20(NC)*; U6 1(NC)* 3(NC)* 4(NC)* 5(NC)* 6(NC)* 7(NC)* 8(NC)* 11(NC)* 12(NC)* 13(~{INT})* 15(LED_DRV)* 18(LED_IND)* 19(NC)* 20(NC)*

### Notes on the sheet
- Spectrometer Cluster
- (near X2) Flash Programming Port
- (near U3) (considers translation)
- Spectrometer Reset
- 1
- 2
- 3
- 4
- A
- B
- C
- Project:
- D
- Date:
- Drawing number:
- Rev:
- Format:
- A4 Q
- Drawn by:
- Laboratory:
- Page
- Sheet:
- of
- File:

### Library data of the parts
C2 C4 C6 C8 = CMP-2006-02298-2: Manufacturer: Kemet; Part Number: C0603C105K4RACTU; Dielectric Material: Ceramic; Multilayer: Yes; Negative Tolerance: 10%; Rated DC Voltage (URdc): 16V; Temperature Characteristics Code: X7R; Supplier 1: Digi-Key; Supplier Part Number 1: 399-C0603C105K4RAC7867DKR-ND; Manufacturer Part Number: C0603C105K4RACTU; RoHS: Yes; Category: Ceramic Capacitors; Stock 1: 1549593; Pricing 1: 1=0.10000, 10=0.07700, 50=0.04180, 100=0.03410, 500=0.02440, 1000=0.01916 (USD); Mount: Surface Mount; Number of Pins: 2; Package Shape: Rectangular; Size Code: 0603; Terminal Finish: Nickel; Min Operating Temperature: -55°C; Max Operating Temperature: 125°C; Value: 1uF; Capacitor Type: Ceramic; Packaging: Tape and Reel; Positive Tolerance: 10%; Termination: Wraparound; JESD-609 Code: e3; Package Style: SMTMeter; Length: 1.6mm; Width: 0.8mm; Height: 0.8mm; REACH SVHC: Yes; RoHS Compliant: Yes; ComponentLink1URL: https://datasheet.ciiva.com:443/pdfs/VipMasterIC/IC/KEME/KEME-S-A0008991654/KEME-S-A0008991654-1.pdf?src-supplier=IHS+Markit; ComponentLink1Description: https://datasheet.ciiva.com:443/pdfs/VipMasterIC/IC/KEME/KEME-S-A0008991654/KEME-S-A0008991654-1.pdf?src-supplier=IHS+Markit
C3 C5 C7 C9 C17 = CMP-2000-05439-1: as C11 on sheet STB_ValidationBoard; Case Size/Dimension: 0402; Tolerance (%): ±10%; Value: 100nF; Manufacturer URL: http://www.samsungsem.com/global/index.jsp; Datasheet URL: https://datasheet.ciiva.com/29198/458718-da-01-en-vs-kondensator-0402-29198423.pdf; Datasheet Version: Nov-10; Supplier 1: Digi-Key; Supplier Part Number 1: 1276-1001-6-ND; RoHS: Yes; Category: Ceramic Capacitors; Stock 1: 24854634; Pricing 1: 1=0.10000, 10=0.02400, 50=0.01300, 100=0.01050, 500=0.00752, 1000=0.00592, 2500=0.00538, 5000=0.00495 (USD); Mount: Surface Mount; Number of Pins: 2; Package Shape: Rectangular; Size Code: 0402; Terminal Finish: Nickel; Min Operating Temperature: -55°C; Max Operating Temperature: 125°C; JESD-609 Code: e3; Capacitor Type: Ceramic; Negative Tolerance: 10%; Packaging: Tape and Reel; Positive Tolerance: 10%; Rated DC Voltage (URdc): 16V; Temperature Characteristics Code: X7R; Termination: Wraparound; Package Style: SMTMeter; Length: 1mm; Width: 0.5mm; Height: 0.55mm; REACH SVHC: Yes; RoHS Compliant: Yes; ComponentLink1URL: https://datasheet.ciiva.com:443/pdfs/VipMasterIC/IC/SEMS/SEMS-S-A0008384515/SEMS-S-A0008872921-1.pdf?src-supplier=IHS+Markit; ComponentLink1Description: https://datasheet.ciiva.com:443/pdfs/VipMasterIC/IC/SEMS/SEMS-S-A0008384515/SEMS-S-A0008872921-1.pdf?src-supplier=IHS+Markit; ComponentLink2URL: https://datasheet.ciiva.com/26920/getdatasheetpartid-359683-26920169.pdf?src-supplier=Verical; ComponentLink2Description: https://datasheet.ciiva.com/26920/getdatasheetpartid-359683-26920169.pdf?src-supplier=Verical; ComponentLink3URL: https://datasheet.ciiva.com/29198/458718-da-01-en-vs-kondensator-0402-29198423.pdf?src-supplier=Conrad; ComponentLink3Description: https://datasheet.ciiva.com/29198/458718-da-01-en-vs-kondensator-0402-29198423.pdf?src-supplier=Conrad; ComponentLink4URL: https://datasheet.ciiva.com/26309/mlcc-catalogdownload2013-eng-26309003.pdf?src-supplier=Distrelec; ComponentLink4Description: https://datasheet.ciiva.com/26309/mlcc-catalogdownload2013-eng-26309003.pdf?src-supplier=Distrelec; ComponentLink5URL: https://datasheet.ciiva.com/16208/cl05b104kq5nnnc-16208343.pdf?src-supplier=Future+Electronics; ComponentLink5Description: https://datasheet.ciiva.com/16208/cl05b104kq5nnnc-16208343.pdf?src-supplier=Future+Electronics
R1-R5 = CMP-2000-07588-1: Chip Resistor, 10 KOhm, +/- 1%, 0.1 W, -55 to 155 degC, 0402 (1005 Metric), RoHS, Tape and Reel; Manufacturer: Panasonic; Manufacturer Part Number: ERJ-2RKF1002X; Power Rating: 100mW; Voltage Rating: 50V; Value: 10 kOhm; Case\/Package: 0402; Temperature Coefficient: 100ppm\/degreesC; Rated Temperature: 70°C; Package Height: 0.35mm; Package Length: 1mm; Package Width: 0.5mm; Reference Standard: AEC-Q200; RoHSCompliant: True; Lead Free: LeadFree; Package Quantity: 1; Contact Plating: Tin; Length: 1mm; Radiation Hardening: No; REACH SVHC: NoSVHC; Max Operating Temperature: 155degC; Depth: 0.5mm; Case Code (Imperial): 0402; Military Standard: Not; Package Description: 2-Pin Surface Mount Device, Body 1 x 0.5 mm; Termination: SMD/SMT; Case Code (Metric): 1005; Height: 0.35mm; Packaging: TapeandReel; Voltage Rating (DC): 50V; Package Reference: 402; Number of Pins: 2; Tolerance: 1%; Mounting Technology: SurfaceMount; Width: 0.02inch; Mount: SurfaceMount; Datasheet URL: https://industrial.panasonic.com/cdbs/www-data/pdf/RDA0000/AOA0000C304.pdf; Composition: ThickFilm; Datasheet Version: 02/2017; Manufacturer URL: http://www.panasonic.com/; Max Power Dissipation: 100mW; Number of Terminations: 2; Min Operating Temperature: -55degC; Supplier 1: Digi-Key; Supplier Part Number 1: P10.0KLDKR-ND; RoHS: Yes; Category: Chip SMD Resistors; Stock 1: 108; Pricing 1: 1=0.10000, 10=0.03300, 100=0.01330, 1000=0.00599, 2500=0.00520, 5000=0.00429 (USD); Size Code: 0402; Terminal Finish: Nickel; Package Shape: Rectangular; Resistor Type: FIXED RESISTOR; Rated Power Dissipation (P): 100mW; Technology: METAL GLAZE/THICK FILM; Working Voltage: 50V; Construction: Rectangular; Package Style: SMTMeter; JESD-609 Code: e3; RoHS Compliant: Yes; ComponentLink1URL: https://datasheet.ciiva.com:443/pdfs/VipMasterIC/IC/PANA/PANA-S-A0009889626/PANA-S-A0009889626-1.pdf?src-supplier=IHS+Markit; ComponentLink1Description: https://datasheet.ciiva.com:443/pdfs/VipMasterIC/IC/PANA/PANA-S-A0009889626/PANA-S-A0009889626-1.pdf?src-supplier=IHS+Markit; ComponentLink2URL: https://datasheet.ciiva.com/11821/0900766b80f80784-11821171.pdf?src-supplier=RSComponents; ComponentLink2Description: https://datasheet.ciiva.com/11821/0900766b80f80784-11821171.pdf?src-supplier=RSComponents; ComponentLink3URL: https://datasheet.ciiva.com/27055/1987020-27055643.pdf?src-supplier=Jameco; ComponentLink3Description: https://datasheet.ciiva.com/27055/1987020-27055643.pdf?src-supplier=Jameco; ComponentLink4URL: https://datasheet.ciiva.com/43467/1678782-43467402.pdf?src-supplier=Farnell; ComponentLink4Description: https://datasheet.ciiva.com/43467/1678782-43467402.pdf?src-supplier=Farnell; ComponentLink5URL: https://datasheet.ciiva.com/28514/1678782-28514185.pdf?src-supplier=Element14; ComponentLink5Description: https://datasheet.ciiva.com/28514/1678782-28514185.pdf?src-supplier=Element14; ComponentLink6URL: https://datasheet.ciiva.com/24023/aoa0000ce2-24023017.pdf?src-supplier=Mouser; ComponentLink6Description: https://datasheet.ciiva.com/24023/aoa0000ce2-24023017.pdf?src-supplier=Mouser; ComponentLink7URL: https://datasheet.ciiva.com/16782/70260748-16782590.pdf?src-supplier=Allied+Electronics; ComponentLink7Description: https://datasheet.ciiva.com/16782/70260748-16782590.pdf?src-supplier=Allied+Electronics; ComponentLink8URL: https://datasheet.ciiva.com/16786/70260748-16786734.pdf?src-supplier=Allied+Electronics; ComponentLink8Description: https://datasheet.ciiva.com/16786/70260748-16786734.pdf?src-supplier=Allied+Electronics; ComponentLink9URL: https://datasheet.ciiva.com/9194/aoa0000ce2-9194142.pdf?src-supplier=Avnet; ComponentLink9Description: https://datasheet.ciiva.com/9194/aoa0000ce2-9194142.pdf?src-supplier=Avnet; ComponentLink10URL: https://datasheet.ciiva.com/16199/aoa0000ce2-16199478.pdf?src-supplier=Future+Electronics; ComponentLink10Description: https://datasheet.ciiva.com/16199/aoa0000ce2-16199478.pdf?src-supplier=Future+Electronics; ComponentLink11URL: https://datasheet.ciiva.com/48531/aoa0000ce2-48531069.pdf?src-supplier=Avnet; ComponentLink11Description: https://datasheet.ciiva.com/48531/aoa0000ce2-48531069.pdf?src-supplier=Avnet; ComponentLink12URL: https://datasheet.ciiva.com/30201/aoa0000ce2-30201022.pdf?src-supplier=Onlinecomponents.com; ComponentLink12Description: https://datasheet.ciiva.com/30201/aoa0000ce2-30201022.pdf?src-supplier=Onlinecomponents.com
SW1 = CMP-2000-06231-1: Light Touch Switch, 100 mOhm, -40 to 85 degC, 4-Pin SMD, RoHS, Tape and Reel; Manufacturer: Panasonic; Part No: EVP-AA002K; Manufacturer Series: EVPAA; Electrical Life: 1000000Cycles; Switch Configuration: N.O.; COO: JP; Actuator Color: Black; Contact Rating @ Voltage: 0.02@15VDCA; Dielectric Strength: 250VAC; Actuator Length: 0.3mm; Ground Terminal: No; Operating Force: 1N; Pole Throw Configuration: SPST; Body Orientation: Straight; Illumination Type: N/R; Maximum DC Voltage Rating: 15V; Actuator Style: RectangularButton; Actuator Angle: 0°; Actuator Travel: 0.127mm; Actuator Type: Pushbutton; Circuit Configuration: 1X1; Contact Bounce Time-Max: 10ms; Contact Current(DC)-Max: 20mA; Contact DC Max Rating R Load: .02A@15VDC; Contact Function: OFF-(ON); Contact Resistance: 0.1mR; Contact Timing: SNAP ACTION; Dielectric Withstand Volts: 250VACV; Insulation Resistance: 100MR; Number of Switches: 1; Switch Action: MOMENTARY; Switch Type: Keypad; Body Breadth: 2.9inch; Body Height: 1.4mm; Body Length or Diameter: 3.5mm; Sealing: MOLDED; Maximum AC Voltage Rating: N/A; Package Description: 4-Pin Surface Mount Device, Body 2.9 x 3.5 mm, Pitch 1.45 mm; Family: EVPAA; Contact Material: N/A; Mounting: SurfaceMount,J-Bend; Datasheet Version: 04/2016; Housing Material: N/A; Product Weight: N/A; RoHS: Yes; Mechanical Life: N/A; Minimum Insulation Resistance: 100MOhm; Operating Temperature: -40to85C; Mounting Technology: SurfaceMount; HTS: 8507204000; Dimension: 4.3x2.9x1.7mm; Maximum Contact Resistance: 100mOhm; Base Material: N/A; Seal Location: N/A; Supplier Standard Pack: 5,000; Supplier: PanasonicIndustrialDevices; Datasheet URL: https://industrial.panasonic.com/cdbs/www-data/pdf/ATV0000/ATV0000C1.pdf; Packaging: EmbossedTapeandReel; Manufacturer URL: http://www.panasonic.com/; Seal Description: N/A; Contact Plating: N/A; ECCN: EAR99; Package Reference: EVPAA; Type: LightTouch; Supplier 1: Digi-Key; Supplier Part Number 1: P13347SDKR-ND; Manufacturer Part Number: EVP-AA002K; Category: Tactile Switches; Stock 1: 2300; Pricing 1: 1=0.87000, 10=0.83400, 25=0.80200, 100=0.69610, 250=0.63516, 500=0.59026, 1000=0.52930, 2500=0.49722 (USD); Mount: Surface Mount; Body Color: Black; Min Operating Temperature: -40°C; Max Operating Temperature: 85°C; Contact Voltage(DC)-Max: 15V; Operating Force-Max: 1N; Switch Function: SPST; Termination: Solder; REACH SVHC: Yes; RoHS Compliant: Yes; ComponentLink1URL: https://datasheet.ciiva.com:443/pdfs/VipMasterIC/IC/PANA/PANA-S-A0001791376/PANA-S-A0001791376-1.pdf?src-supplier=IHS+Markit; ComponentLink1Description: https://datasheet.ciiva.com:443/pdfs/VipMasterIC/IC/PANA/PANA-S-A0001791376/PANA-S-A0001791376-1.pdf?src-supplier=IHS+Markit; ComponentLink2URL: https://datasheet.ciiva.com/24076/atk0000pe184-69004-24076293.pdf?src-supplier=Mouser; ComponentLink2Description: https://datasheet.ciiva.com/24076/atk0000pe184-69004-24076293.pdf?src-supplier=Mouser; ComponentLink3URL: https://datasheet.ciiva.com/30108/atk0000ce26-30108515.pdf?src-supplier=Onlinecomponents.com; ComponentLink3Description: https://datasheet.ciiva.com/30108/atk0000ce26-30108515.pdf?src-supplier=Onlinecomponents.com; ComponentLink4URL: https://datasheet.ciiva.com/17016/70270676-17016874.pdf?src-supplier=Allied+Electronics; ComponentLink4Description: https://datasheet.ciiva.com/17016/70270676-17016874.pdf?src-supplier=Allied+Electronics; ComponentLink5URL: https://datasheet.ciiva.com/16395/atk0000ce26-16395244.pdf?src-supplier=Future+Electronics; ComponentLink5Description: https://datasheet.ciiva.com/16395/atk0000ce26-16395244.pdf?src-supplier=Future+Electronics; ComponentLink6URL: https://datasheet.ciiva.com/2899/atk0000ce26-2899991.pdf?src-supplier=Digi-Key; ComponentLink6Description: https://datasheet.ciiva.com/2899/atk0000ce26-2899991.pdf?src-supplier=Digi-Key; ComponentLink7URL: https://datasheet.ciiva.com/2899/atk0000ce26-2899992.pdf?src-supplier=Digi-Key; ComponentLink7Description: https://datasheet.ciiva.com/2899/atk0000ce26-2899992.pdf?src-supplier=Digi-Key; ComponentLink8URL: https://datasheet.ciiva.com/2899/atk0000ce26-2899990.pdf?src-supplier=Digi-Key; ComponentLink8Description: https://datasheet.ciiva.com/2899/atk0000ce26-2899990.pdf?src-supplier=Digi-Key
U3 = CMP-22831-000005-1: AS72651-BLGT LGA20 LF T&RDP; Manufacturer: ams; Frequency: 50MHz; Frequency Stability: 25ppm; Max Supply Current: 8mA; Min Operating Temperature: -40°C; Max Operating Temperature: 85°C; Mount: Surface Mount; Number of Pins: 20; Packaging: Tape and Reel; Case/Package: SMD/SMT; Supplier 1: Digi-Key; Supplier Part Number 1: AS72651-BLGTDKR-ND; Manufacturer Part Number: AS72651-BLGT; RoHS: No; Category: LED Drivers; ComponentLink1URL: https://ams.com/documents/20143/36005/AS7265x_DS000612_1-00.pdf?src-supplier=Digi-Key; ComponentLink1Description: https://ams.com/documents/20143/36005/AS7265x_DS000612_1-00.pdf?src-supplier=Digi-Key
U4 = CMP-0467-00001-2: 4 M-Bit [x1 / x2] CMOS Serial Flash, 86 MHz, -0.7 to 3.6 V, -40 to 85 degC, Body  2 x 3 x 0.6 mm; Manufacturer: Macronix; Frequency(MHz): 86; Density: 4 Mb; Bus Width: x1, x2; Sector Type: 4 KB, 64 KB; Operating Current(mA): 12; Vin: -2.7 to 3.6 V; Standby Current(uA): 10; Package Body Material: Plastic; Alternate Memory Width: 1; Clock Frequency-Max (fCLK): 86MHz; Memory Width: 2; Number of Words: 2097152; Number of Words Code: 2M; Operating Mode: SYNCHRONOUS; Organization: 2MX2; Programming Voltage: 2.7V; Supply Voltage-Max (Vsup): 3.6V; Supply Voltage-Nom (Vsup): 3V; Data Retention Time-Min: 20; Endurance: 100000Cycles; Power Supplies: 3/3.3V; Serial Bus Type: SPI; Standby Current-Max: 10uA; Max Supply Current: 20uA; Write Protection: HARDWARE/SOFTWARE; Qualification Status: Not Qualified; Operationg Tempertaure Range: -40 to 85 degC; ComponentLink3Description: Package Specification; PackageReference: USON-8; PartNumber: MX25L4006EZUI-12G; Mounting Technology: Surface Mount; ComponentLink1Description: Manufacturer URL; ComponentLink2URL: http://www.macronix.com/QuickPlace/hq/PageLibrary4825740B00298A3B.nsf/h_Index/3F21BAC2E121E17848257639003A3146/$File/MX25L4006E,%203V,%204Mb,%20v1.3.pdf; ComponentLink1URL: http://www.macronix.com; PackageDescription: 8-Pin Small Outline No-lead Package, Body 2 x 3mm, Pitch 0.5 mm; ComponentLink3URL: http://www.macronix.com/QuickPlace/hq/PageLibrary4825740B00298A3B.nsf/h_Index/3F21BAC2E121E17848257639003A3146/$File/MX25L4006E,%203V,%204Mb,%20v1.3.pdf; PackageVersion: Rev. 3; ComponentLink2Description: Datasheet; DatasheetVersion: Rev. 1.3; Supplier 1: Digi-Key; Supplier Part Number 1: 1092-1154-1-ND; Manufacturer Part Number: MX25L4006EZUI-12G; RoHS: Yes; Category: Flash; Stock 1: 48100; Pricing 1: 1=0.73000, 10=0.66700, 25=0.65880, 50=0.65480, 100=0.58540, 250=0.58048, 500=0.57188, 1000=0.55143, 5000=0.50226 (USD); Package Code: HVSON; Number of Pins: 8; Package Shape: Rectangular; Terminal Finish: Tin; Min Operating Temperature: -40°C; Max Operating Temperature: 85°C; JESD-609 Code: e3; Memory Type: FLASH; Type: NOR TYPE; JESD-30 Code: R-PDSO-N8; Moisture Sensitivity Level: 3; Number of Functions: 1; Package Style: SMALL OUTLINE, HEAT SINK/SLUG, VERY THIN PROFILEMeter; Parallel/Serial: SERIAL; Supply Voltage-Min (Vsup): 2.7V; Surface Mount: Yes; Technology: CMOS; Terminal Form: No Lead; Terminal Position: DUAL; Length: 3mm; Width: 2mm; Height - Seated (Max): 0.6mm; Terminal Pitch: 0.5mm; Temperature Grade: INDUSTRIAL; REACH SVHC: No SVHC; RoHS Compliant: Yes; ComponentLink4URL: https://datasheet.ciiva.com:443/pdfs/VipMasterIC/IC/MXMA/MXMA-S-A0007770252/MXMA-S-A0007770252-1.pdf?src-supplier=IHS+Markit; ComponentLink4Description: https://datasheet.ciiva.com:443/pdfs/VipMasterIC/IC/MXMA/MXMA-S-A0007770252/MXMA-S-A0007770252-1.pdf?src-supplier=IHS+Markit; ComponentLink5URL: http://www.macronix.com/Lists/Datasheet/Attachments/5087/MX25L4006E,%203V,%204Mb,%20v1.6.pdf?src-supplier=Digi-Key; ComponentLink5Description: http://www.macronix.com/Lists/Datasheet/Attachments/5087/MX25L4006E,%203V,%204Mb,%20v1.6.pdf?src-supplier=Digi-Key; ComponentLink6URL: http://ckassoc.com/oldsite/pdf/Macronix_Product_Line_Card_July_2017_General%20_070617.pdf?src-supplier=Digi-Key; ComponentLink6Description: http://ckassoc.com/oldsite/pdf/Macronix_Product_Line_Card_July_2017_General%20_070617.pdf?src-supplier=Digi-Key; ComponentLink7URL: http://www.macronix.com/Lists/Datasheet/Attachments/7604/MX25L4006E,%203V,%204Mb,%20v1.7.pdf?src-supplier=Digi-Key; ComponentLink7Description: http://www.macronix.com/Lists/Datasheet/Attachments/7604/MX25L4006E,%203V,%204Mb,%20v1.7.pdf?src-supplier=Digi-Key; ComponentLink8URL: http://www.macronix.com/QuickPlace/hq/PageLibrary4825740B00298A3B.nsf/h_Index/3F21BAC2E121E17848257639003A3146/$File/MX25L4006E,%203V,%204Mb,%20v1.4.pdf?src-supplier=Future+Electronics; ComponentLink8Description: http://www.macronix.com/QuickPlace/hq/PageLibrary4825740B00298A3B.nsf/h_Index/3F21BAC2E121E17848257639003A3146/$File/MX25L4006E,%203V,%204Mb,%20v1.4.pdf?src-supplier=Future+Electronics
U5 = CMP-22831-000003-1: AS72653-BLGT LGA20 LF T&RDP; Manufacturer: ams; Packaging: Cut Tape; Number of Pins: 20; Case/Package: LGA; Mount: Surface Mount; Supplier 1: Digi-Key; Supplier Part Number 1: AS72653-BLGTDKR-ND; Manufacturer Part Number: AS72653-BLGT; RoHS: No; Category: LED Drivers; ComponentLink1URL: https://ams.com/documents/20143/36005/AS7265x_DS000612_1-00.pdf?src-supplier=Digi-Key; ComponentLink1Description: https://ams.com/documents/20143/36005/AS7265x_DS000612_1-00.pdf?src-supplier=Digi-Key
U6 = CMP-22831-000001-1: AS72652-BLGT LGA20 LF T&RDP; Manufacturer: ams; Packaging: Cut Tape; Case/Package: LGA; Number of Pins: 20; Mount: Surface Mount; Supplier 1: Digi-Key; Supplier Part Number 1: AS72652-BLGTDKR-ND; Manufacturer Part Number: AS72652-BLGT; RoHS: No; Category: LED Drivers; ComponentLink1URL: https://ams.com/documents/20143/36005/AS7265x_DS000612_1-00.pdf?src-supplier=Digi-Key; ComponentLink1Description: https://ams.com/documents/20143/36005/AS7265x_DS000612_1-00.pdf?src-supplier=Digi-Key
X2 = CMP-00723-1: CABLE, TAG CONNECT, WITH OUT LEG, FOR IC; Number of Pins: 6; Package Quantity: 1; Packaging: Bulk; REACH SVHC: No SVHC; Lead Free: Lead Free